# EAGLE design shield (EAGLE 9.5.1)
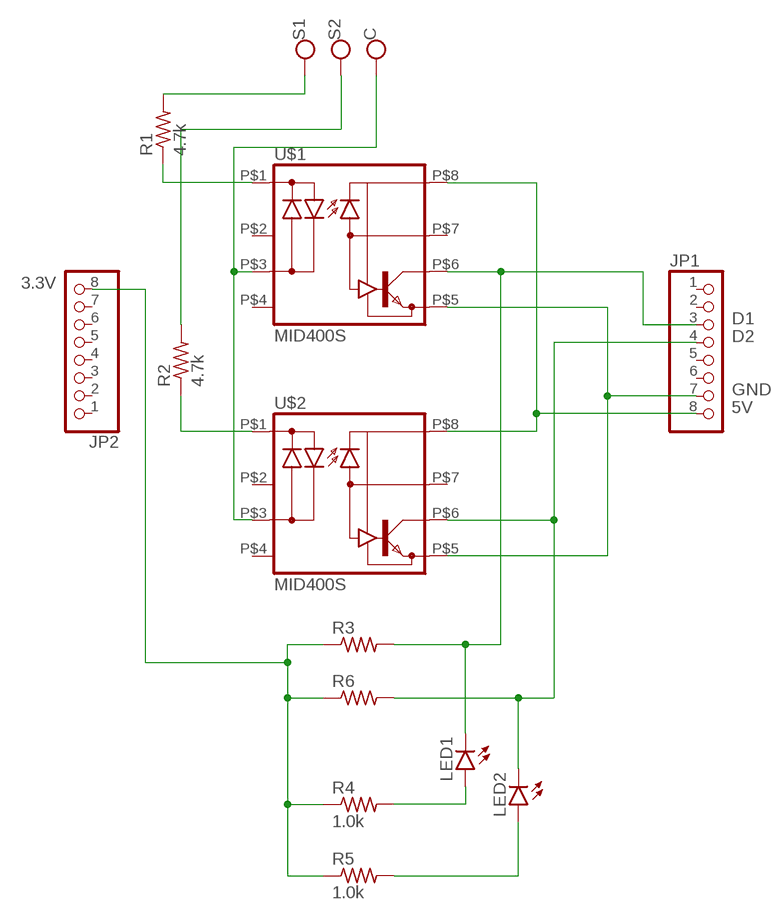
[diagram p0: schematic, sheet 1]

## Parts
JP1  PINHD-1X8/OCT  [1X08/OCT]
JP2  PINHD-1X8/OCT  [1X08/OCT]
LED1  LEDSML0603  [SML0603]
LED2  LEDSML0603  [SML0603]
R1  4.7k  R-US_R0603  [R0603]
R2  4.7k  R-US_R0603  [R0603]
R3  R-US_R0603  [R0603]
R4  1.0k  R-US_R0603  [R0603]
R5  1.0k  R-US_R0603  [R0603]
R6  R-US_R0603  [R0603]
U$1  MID400S  [SMT8]
U$2  MID400S  [SMT8]
X1  AK550/3QUIET  [AK550/3-N]

## Nets
3.3V: JP2.8 R3.1 R4.1 R5.1 R6.1
5V: JP1.8 U$1.P$8(VCC) U$2.P$8(VCC)
C: U$1.P$3(AC2) U$2.P$3(AC2) X1.1
D1: JP1.3 LED1.C R3.2 U$1.P$6(VO)
D2: JP1.4 LED2.C R6.2 U$2.P$6(VO)
GND: JP1.7 U$1.P$5(GND) U$2.P$5(GND)
N$9: R2.1 U$2.P$1(AC1)
N$10: R1.1 U$1.P$1(AC1)
N$11: LED2.A R5.2
N$12: LED1.A R4.2
S1: R1.2 X1.3
S2: R2.2 X1.2
Unconnected: JP1.1 JP1.2 JP1.5 JP1.6 JP2.1 JP2.2 JP2.3 JP2.4 JP2.5 JP2.6 JP2.7 U$1.P$2(NC1) U$1.P$4(NC2) U$1.P$7(AUX) U$2.P$2(NC1) U$2.P$4(NC2) U$2.P$7(AUX)

## Library data of the parts
JP1 JP2 = pinhead_v2:PINHD-1X8: PIN HEADER
LED1 LED2 = led:LED: LED OSRAM: - CHIPLED LG R971, LG N971, LY N971, LG Q971, LY Q971, LO R971, LY R971 LH N974, LH R974 LS Q976, LO Q976, LY Q976 LO Q996 - Hyper CHIPLED LW Q18S LB Q993, LB Q99A, LB R99A - SideLED LS A670, LO A670, LY A670, LG A670, LP A670 LB A673, LV A673, LT A673, LW A673 LH A674 LY A675 LS A676, LA A676, LO A676, LY A676, LW A676 LS A679, LY A679, LG A679 - Hyper Micro SIDELED® LS Y876, LA Y876, LO Y876, LY Y876 LT Y87S - SmartLED LW L88C, LW L88S LB L89C, LB L89S, LG L890 LS L89K, LO L89K, LY L89K LS L896, LA L896, LO L896, LY L896 - TOPLED LS T670, LO T670, LY T670, LG T670, LP T670 LSG T670, LSP T670, LSY T670, LOP T670, LYG T670 LG T671, LOG T671, LSG T671 LB T673, LV T673, LT T673, LW T673 LH T674 LS T676, LA T676, LO T676, LY T676, LB T676, LH T676, LSB T676, LW T676 LB T67C, LV T67C, LT T67C, LS T67K, LO T67K, LY T67K, LW E67C LS E67B, LA E67B, LO E67B, LY E67B, LB E67C, LV E67C, LT E67C LW T67C LS T679, LY T679, LG T679 LS T770, LO T770, LY T770, LG T770, LP T770 LB T773, LV T773, LT T773, LW T773 LH T774 LS E675, LA E675, LY E675, LS T675 LS T776, LA T776, LO T776, LY T776, LB T776 LHGB T686 LT T68C, LB T68C - Hyper Mini TOPLED® LB M676 - Mini TOPLED Santana® LG M470 LS M47K, LO M47K, LY M47K Source: http://www.osram.convergy.de LUXEON: - LUMILED® LXK2-PW12-R00, LXK2-PW12-S00, LXK2-PW14-U00, LXK2-PW14-V00 LXK2-PM12-R00, LXK2-PM12-S00, LXK2-PM14-U00 LXK2-PE12-Q00, LXK2-PE12-R00, LXK2-PE12-S00, LXK2-PE14-T00, LXK2-PE14-U00 LXK2-PB12-K00, LXK2-PB12-L00, LXK2-PB12-M00, LXK2-PB14-N00, LXK2-PB14-P00, LXK2-PB14-Q00 LXK2-PR12-L00, LXK2-PR12-M00, LXK2-PR14-Q00, LXK2-PR14-R00 LXK2-PD12-Q00, LXK2-PD12-R00, LXK2-PD12-S00 LXK2-PH12-R00, LXK2-PH12-S00 LXK2-PL12-P00, LXK2-PL12-Q00, LXK2-PL12-R00 Source: www.luxeon.com KINGBRIGHT: KA-3528ASYC Source: www.kingbright.com
R1-R6 = resistor:R-US_: RESISTOR, American symbol
U$1 U$2 = shield:MID400S
X1 = shield:AK550/3: CONNECTOR

## Board
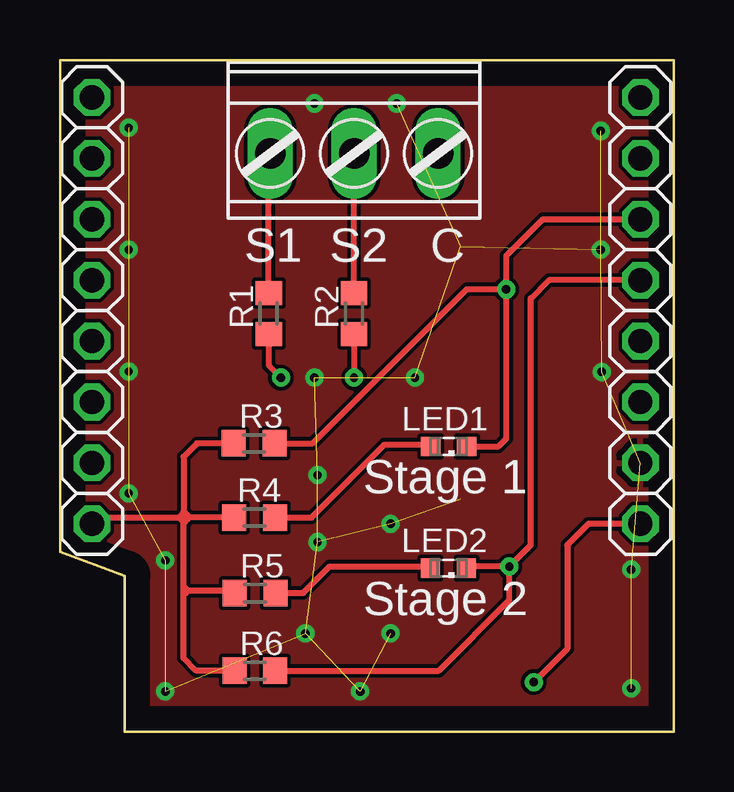
[diagram p1: board, top side]
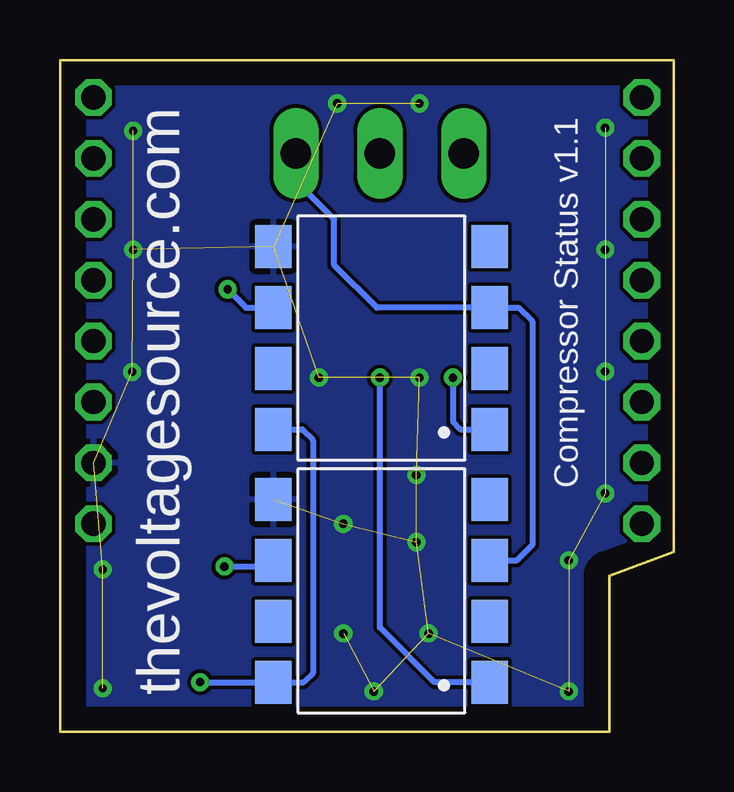
[diagram p2: board, bottom side, seen from below]

Size 25.6 x 28 mm. Coordinates in mm from the lower left corner, seen from the top.
Outline: 0,7.5 0,28 25.6,28 25.6,0 2.7,0 2.7,6.5 0,7.5
Copper layers (1*16): Top 0.035mm / dielectric 1.5mm / Bottom 0.035mm
Design rules "default": minimum track width 6mil, minimum drill 0.35mm, track to track 6mil, track to pad 6mil, pad to pad 6mil, via to via 6mil, smd to smd 6mil, copper to edge 40mil, drill to drill 6mil, minimum pad ring 10mil, minimum via ring 8mil, stop-mask expansion 4mil, vias tented up to drill 0mil, thermal gap 10mil

### Footprints (pad centres in the part's own frame; a part is rotated, then mirrored left to right if it is on the bottom)
1X08/OCT = drill 1.016 octagon: 1 -8.89,0; 2 -6.35,0; 3 -3.81,0; 4 -1.27,0; 5 1.27,0; 6 3.81,0; 7 6.35,0; 8 8.89,0
SML0603 = smd 0.8 x 0.8: A 0.75,0; C -0.75,0
R0603 = smd 1 x 1.1: 1 -0.85,0; 2 0.85,0
SMT8 = smd 1.78 x 1.52: P$1 0,0; P$2 2.54,0; P$3 5.08,0; P$4 7.62,0; P$5 7.62,9.01; P$6 5.08,9.01; P$7 2.54,9.01; P$8 0,9.01
AK550/3-N = drill 1.27 long: 1 -3.5,0; 2 0,0; 3 3.5,0

### Placement (x,y rotation side)
JP1  24.2,17.55 270 top
JP2  1.34,17.55 270 top
LED1  16.21,11.89 180 top
LED2  16.19,6.81 180 top
R1  8.71,17.42 90 top
R2  12.26,17.42 90 top
R3  8.1,12.01 0 top
R4  8.11,8.92 0 top
R5  8.14,5.77 0 top
R6  8.12,2.54 0 top
U$1  7.69,12.6 90 bottom
U$2  7.69,2.06 90 bottom
X1  12.26,24.1 180 top

### Tracks (layer width: path | path; a pad name or v marks a point on that pad's centre or on a via)
3.3V
  Top 0.152: 7.25,11.72 7.25,11.96 | 7.25,11.96 R3.1 | 7.12,12.09 7.25,11.96 | 1.6,8.92 JP2.8 | 7.19,5.87 R5.1
  Top 0.254: R4.1 5.34,8.92 | 5.15,8.92 5.34,8.92 | 1.6,8.92 4.96,8.92 | 5.15,8.92 4.96,8.92 | R3.1 5.71,12.01 5.15,11.45 5.15,9.17 | 5.15,8.92 5.15,9.11 | R6.1 5.68,2.54 5.15,3.07 5.15,5.74 | 7.19,5.87 5.34,5.87 | 5.34,5.87 5.15,5.87 | 5.15,8.92 5.15,8.73 | 5.15,5.74 5.15,6.06 | 5.15,6.06 5.15,8.67 | 5.15,9.17 5.34,8.98 5.34,8.92 | 5.34,8.92 5.34,8.86 5.15,8.67 | 5.15,8.67 5.15,8.73 | 5.15,8.73 4.96,8.92 | 4.96,8.92 5.15,9.11 | 5.15,9.11 5.15,9.17 | 5.15,6.06 5.34,5.87 | 5.34,5.87 5.22,5.74 5.15,5.74
5V  (via drill 0.35)
  Top 0.254: JP1.8 22.04,8.66 21.15,7.77 21.15,3.45 v19.76,2.06
  Bottom 0.254: v19.76,2.06 U$2.P$8 15.44,2.06 15.06,2.44 15.06,12.16 15.5,12.6 U$1.P$8
C
  Bottom 0.254: X1.1 15.76,22.96 14.17,21.36 14.17,19.46 12.39,17.68 U$1.P$3 6.48,17.68 5.91,17.11 5.91,7.77 6.55,7.14 U$2.P$3
D1  (via drill 0.35)
  Top 0.254: R3.2 10.54,12.01 16.96,18.44 v18.61,18.44 | LED1.C 18.28,11.89 18.61,12.22 v18.61,18.44 | v18.61,18.44 18.61,19.84 20.14,21.36 JP1.3
  Bottom 0.254: v18.61,18.44 17.85,17.68 U$1.P$6
D2  (via drill 0.35)
  Top 0.152: 17.01,6.88 LED2.C | R6.2 9,2.56
  Top 0.254: JP1.4 20.39,18.82 19.63,18.06 19.63,7.77 v18.74,6.88 | v18.74,6.88 17.01,6.88 | R6.2 15.79,2.54 18.74,5.49 v18.74,6.88
  Bottom 0.152: 16.95,6.88 U$2.P$6
  Bottom 0.254: v18.74,6.88 16.95,6.88
GND  (via drill 0.35)  (23 unrouted)
  other vias: 2.86,15.01 2.86,20.09 2.86,25.17 22.55,25.04 22.55,20.09 10.61,14.76 10.74,10.69 2.86,9.93 23.82,6.75 22.59,14.99 12.52,1.68 4.39,1.68 23.82,1.8 4.39,7.14 10.61,26.19 14.04,26.19 10.23,4.09 10.74,7.9 14.8,14.76 13.79,8.66 13.79,4.09
  pour Bottom: 0.45,27.58 25.34,27.58 25.34,0.28 3.12,0.28 2.99,0.4 2.99,6.5 2.23,7.26 1.59,7.26 1.34,7.52 1.09,7.52 0.71,7.9 0.45,7.9
  pour Top: 0.45,27.58 25.34,27.58 25.34,0.4 3.12,0.4 3.12,6.88 2.86,7.14 2.1,7.14 1.85,7.39 1.72,7.39 1.59,7.52 0.71,7.52 0.45,7.77
N$9  (via drill 0.35)
  Top 0.254: R2.1 v12.26,14.76
  Bottom 0.254: v12.26,14.76 12.26,4.34 9.98,2.06 U$2.P$1
N$10  (via drill 0.35)
  Top 0.254: v9.21,14.76 8.71,15.26 R1.1
  Bottom 0.254: 7.88,12.6 U$1.P$1 8.89,12.6 9.21,12.92 v9.21,14.76
N$11
  Top 0.152: 15.37,6.88 LED2.A
  Top 0.254: R5.2 10.14,5.77 11.25,6.88 15.37,6.88
N$12
  Top 0.152: 15.38,11.96 LED1.A
  Top 0.254: R4.2 10.49,8.92 13.53,11.96 15.38,11.96
S1
  Top 0.152: 8.71,24.05 X1.3
  Top 0.254: R1.2 8.71,24.05
S2
  Top 0.254: R2.2 X1.2

### Text on the board
tNames: S1 | S2 | C | Stage 1 | Stage 2
bNames: Compressor Status v1.1 | thevoltagesource.com